# Altium schematic sheet Battery_Module_Dev_Contacts.SchDoc: Battery Connections
size B; DrawnBy: DJW; DocumentNumber: 9; SheetNumber: 9; SheetTotal: 17
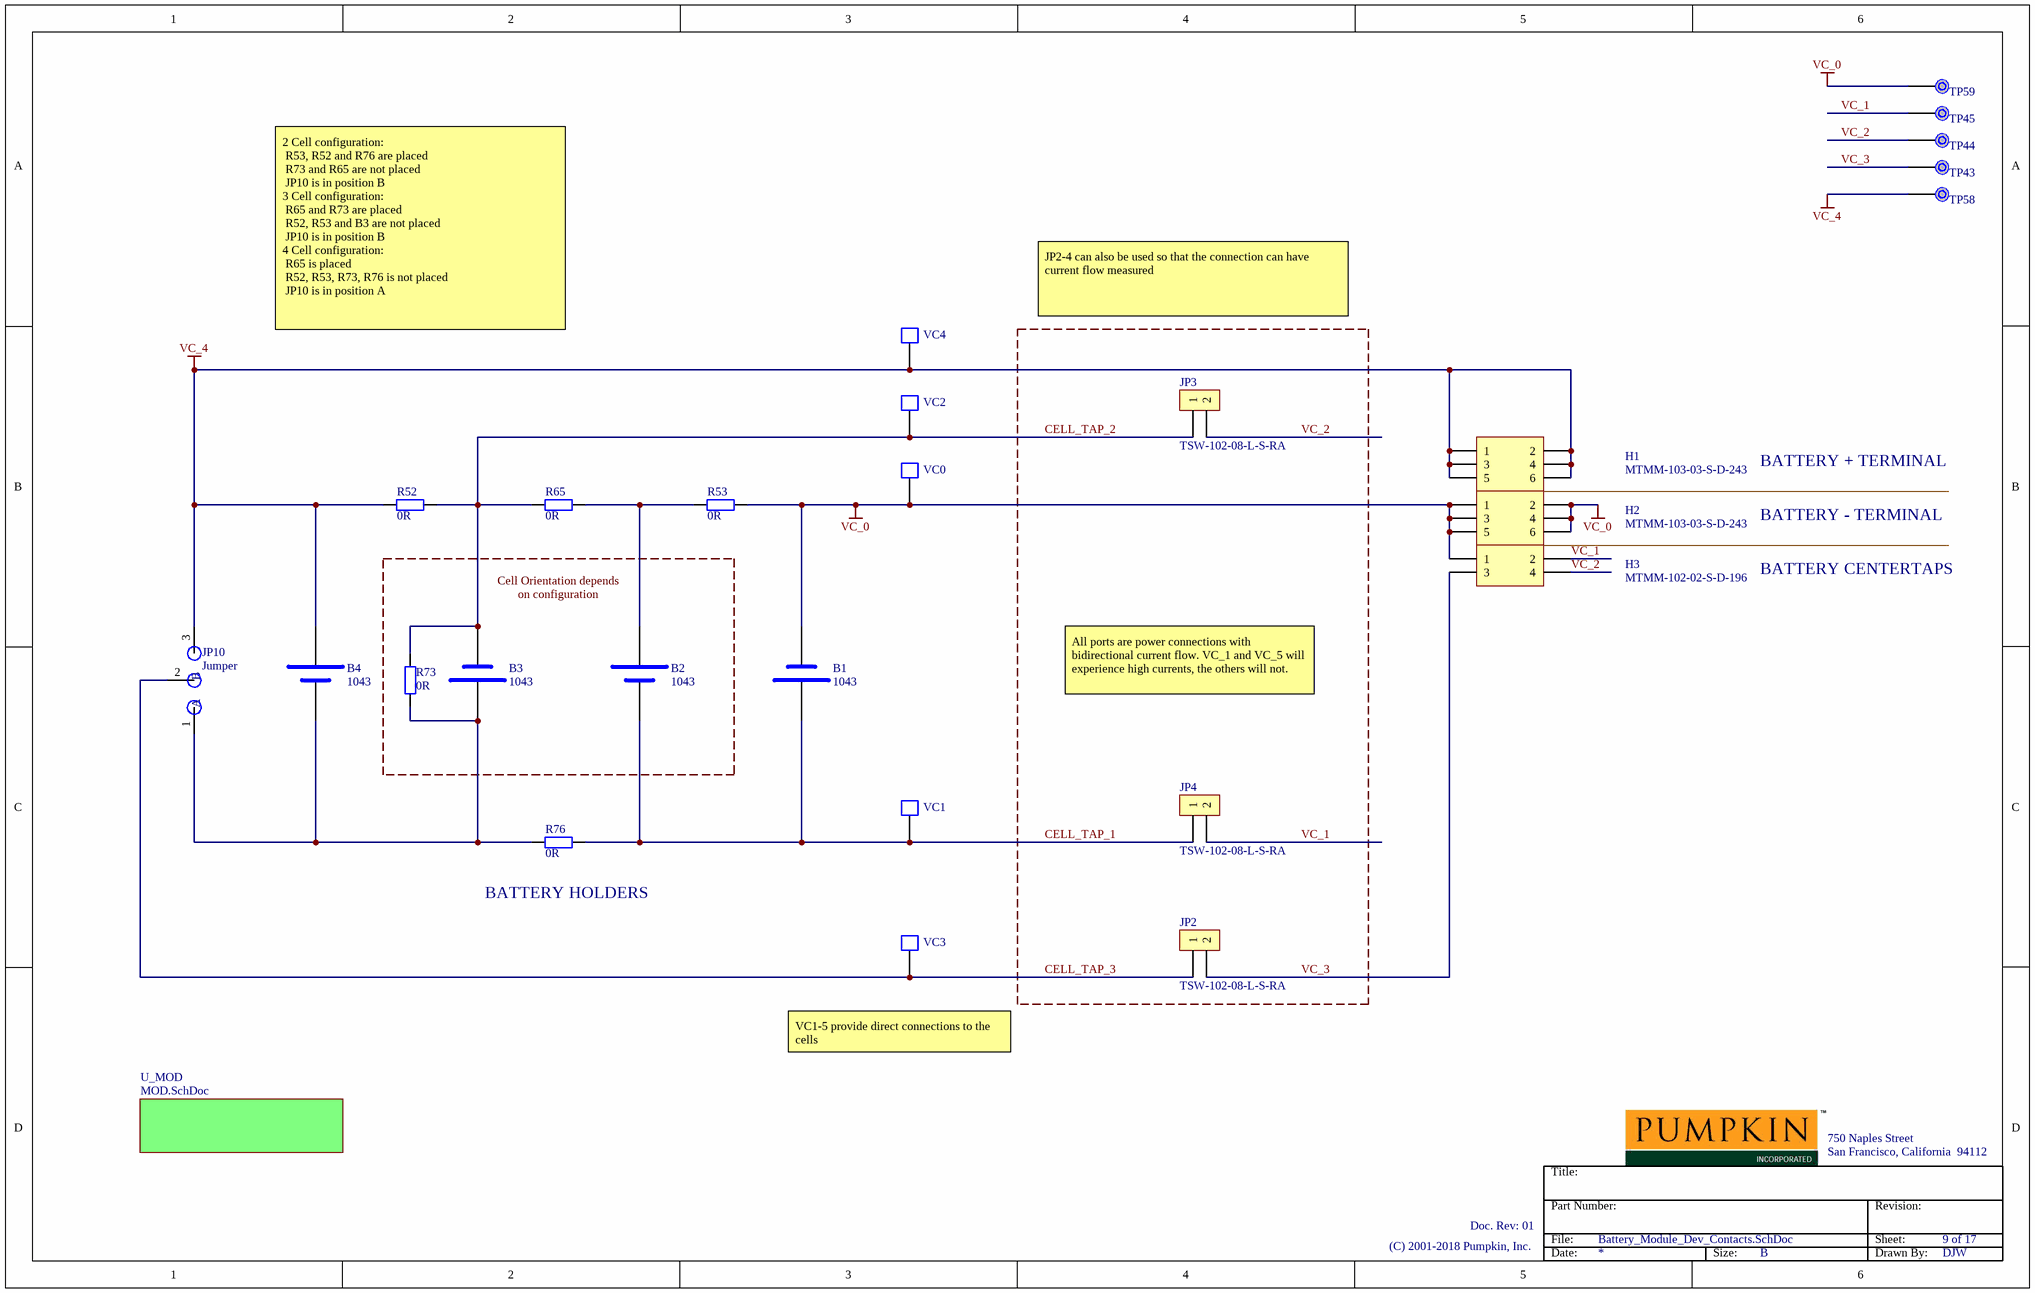
[diagram p0: Battery_Module_Dev_Contacts.SchDoc]

## Parts
B1  1043  [1043]
B2  1043  [1043 - non-polar]
B3  1043  [1043 - non-polar]
B4  1043  [1043]
H1  MTMM-103-03-S-D-243  [MTMM-103-03-S-D-243]
H2  MTMM-103-03-S-D-243  [MTMM-103-03-S-D-243]
H3  MTMM-102-02-S-D-196  [MTMM-102-02-S-D-196]
JP2  TSW-102-08-L-S-RA  [HDR1X2HTH]
JP3  TSW-102-08-L-S-RA  [HDR1X2HTH]
JP4  TSW-102-08-L-S-RA  [HDR1X2HTH]
JP10  Jumper  [0805 RES 2 way jumper]
R52  0R  [2512 RES]
R53  0R  [2512 RES]
R65  0R  [2512 RES]
R73  0R  [2512 RES]
R76  0R  [2512 RES]
TP43  Testpoint  [Testpoint]  (value not drawn)  (no BOM)
TP44  Testpoint  [Testpoint]  (value not drawn)  (no BOM)
TP45  Testpoint  [Testpoint]  (value not drawn)  (no BOM)
TP58  Testpoint  [Testpoint]  (value not drawn)  (no BOM)
TP59  Testpoint  [Testpoint]  (value not drawn)  (no BOM)
VC0  Hook  [Hook]  (value not drawn)
VC1  Hook  [Hook]  (value not drawn)
VC2  Hook  [Hook]  (value not drawn)
VC3  Hook  [Hook]  (value not drawn)
VC4  Hook  [Hook]  (value not drawn)

## Sub-sheets
U_MOD = MOD.SchDoc: no entries

## Nets
VC_0: B1.2 H2.1 H2.2 H2.3 H2.4 H2.5 H2.6 H3.1 R53.1 TP59.1 VC0.1(Hook)
VC_4: B4.1 H1.1 H1.2 H1.3 H1.4 H1.5 H1.6 JP10.3 R52.1 TP58.1 VC4.1(Hook)
CELL_TAP_1: B1.1 B2.2 JP4.1 R76.1 VC1.1(Hook)
CELL_TAP_2: B3.2 JP3.1 R52.2 R65.2 R73.2 VC2.1(Hook)
CELL_TAP_3: JP2.1 JP10.2 VC3.1(Hook)
VC_1: H3.2 JP4.2 TP45.1
VC_2: H3.4 JP3.2 TP44.1
VC_3: H3.3 JP2.2 TP43.1
NetB2_1: B2.1 R53.2 R65.1
NetB3_1: B3.1 B4.2 JP10.1 R73.1 R76.2

## Notes on the sheet
- 2 Cell configuration:
  R53, R52 and R76 are placed
  R73 and R65 are not placed
  JP10 is in position B
  3 Cell configuration:
  R65 and R73 are placed
  R52, R53 and B3 are not placed
  JP10 is in position B
  4 Cell configuration:
  R65 is placed
  R52, R53, R73, R76 is not placed
  JP10 is in position A
- JP2-4 can also be used so that the connection can have current flow measured
- BATTERY + TERMINAL
- BATTERY - TERMINAL
- Cell Orientation depends on configuration
- BATTERY CENTERTAPS
- All ports are power connections with bidirectional current flow. VC_1 and VC_5 will experience high currents, the others will not.
- (near R76) BATTERY HOLDERS
- VC1-5 provide direct connections to the cells
- Title:
- 750 Naples Street
- San Francisco, California  94112
- Doc. Rev: 01
- File:
- Part Number:
- Revision:
- Sheet:
- (C) 2001-2018 Pumpkin, Inc.
- Date:
- Size:
- B
- Drawn By:
- (in symbol Jumper 2 way 0805) B; A

## Library data of the parts
B1-B4 = 1043: Battery 18650 Holder; Supplier 1: Digi-Key; Supplier Part Number 1: 36-1043-ND; Supplier 2: Mouser; Supplier Part Number 2: 534-1043
H1 H2 = MTMM-103-03-S-D-243: Header 3x2 TH thru-board 2mm; Supplier 1: Digi-Key; Supplier Part Number 1: MTMM-103-03-G-D-243-ND; Supplier 2: Digi-Key; Supplier Part Number 2: MTMM-103-03-G-D-000-ND
H3 = MTMM-102-02-S-D-196: Header 2x2 TH thru-board 2mm; Supplier 1: Digi-Key; Supplier 2: Digi-Key; Supplier Part Number 2: MTMM-102-02-G-D-196-ND; Supplier Part Number 1: MTMM-102-02-S-D-196-ND
JP2-JP4 = TSW-102-08-L-S-RA: Header 2x1 RA TH; Supplier 1: Digi-Key; Supplier Part Number 1: SAM1043-02-ND; Supplier 2: Digi-Key; Supplier 3: Digi-Key; Supplier 4: Digi-Key; Supplier Part Number 2: SAM10325-ND; Supplier Part Number 3: HTSW-102-08-G-S-RA-ND; Supplier Part Number 4: SAM1039-02-ND
JP10 = Jumper 2 way 0805: Jumper 0805 2 pos; Supplier 1: Digi-Key; Supplier Part Number 1: P0.0ACT-ND; Supplier 2: Digi-Key; Supplier Part Number 2: 311-0.0CRCT-ND
R52 R53 R65 R73 R76 = Resistor 0R 2512: Resistor 0R 2512 1W; Revision: Altium ETH 11-03.2008; Value: 0R; Supplier 1: Digi-Key; Supplier Part Number 1: YAG1232CT-ND; Supplier 2: Digi-Key; Supplier 3: Digi-Key; Supplier Part Number 2: RMCF2512ZT0R00CT-ND; Supplier Part Number 3: 1276-6000-1-ND
VC0-VC4 = Hook: Testpoint Hook; Manufacturer: Keystone Electronics; Manufacturer Part Number: 5016; Supplier 1 Pricing: 0.60 (NZD); Supplier 1: Digi-Key; Supplier Part Number 1: 36-5016CT-ND; Supplier 2: Digi-Key; Supplier Part Number 2: 36-5018CT-ND
TP43-TP45 TP58 TP59 = Testpoint: Supplier 1: Digi-Key; Supplier 2: Digi-Key; Supplier Part Number 1: 36-5002-ND; Supplier Part Number 2: 36-5001-ND